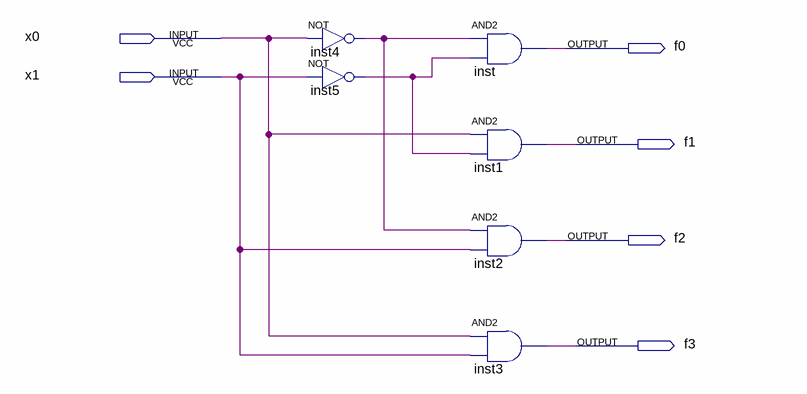
[diagram p0: schematic sheet]
// Quartus schematic Decoder.bdf as structural Verilog: 6 symbols, 6 pins
module Decoder (
  input  x0,
  input  x1,
  output f0,
  output f1,
  output f2,
  output f3
);

  wire inst4_out, inst5_out;

  not inst4 (inst4_out, x0);
  not inst5 (inst5_out, x1);
  and inst (f0, inst4_out, inst5_out);
  and inst1 (f1, x0, inst5_out);
  and inst2 (f2, inst4_out, x1);
  and inst3 (f3, x0, x1);
endmodule
